# Altium schematic sheet Linear_Voltage_Regulators_Top_Level.SchDoc
size Letter; SheetNumber: 1; SheetTotal: 3
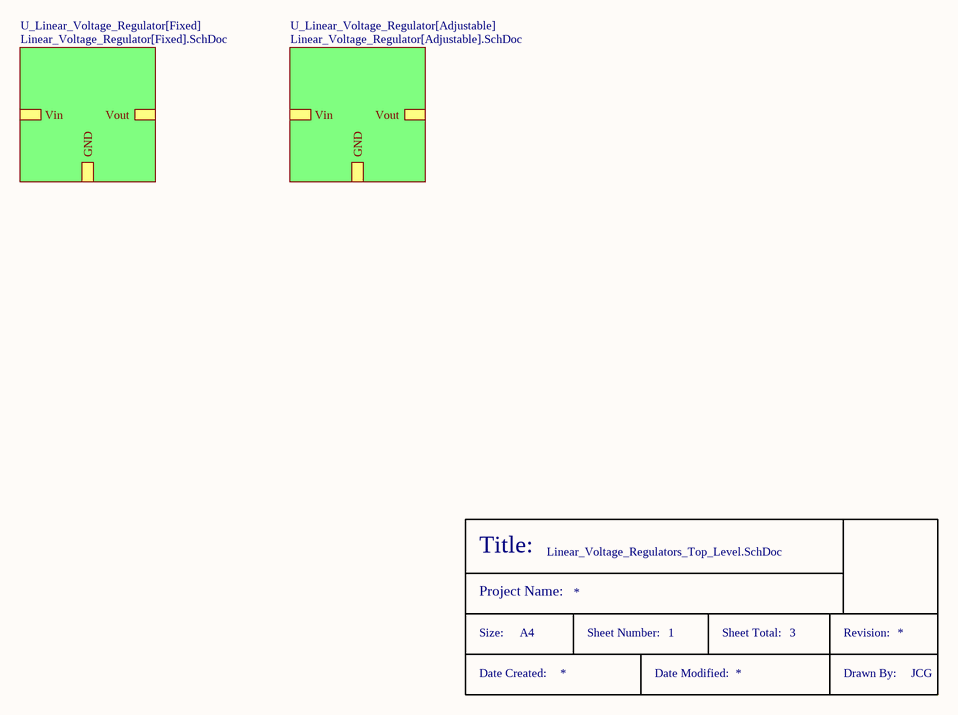
[diagram p0: Linear_Voltage_Regulators_Top_Level.SchDoc]

## Parts
*  Title_Block  (value not drawn)

## Sub-sheets
U_Linear_Voltage_Regulator[Adjustable] = Linear_Voltage_Regulator[Adjustable].SchDoc: Vout, Vin, GND
U_Linear_Voltage_Regulator[Fixed] = Linear_Voltage_Regulator[Fixed].SchDoc: Vin, Vout, GND

## Notes on the sheet
- (in symbol Title_Block) Title:; Project Name:; Size:; A4; Sheet Number:; Sheet Total:; Revision:; Date Created:; Date Modified:; Drawn By:; JCG